# Altium schematic sheet bluenrg.SchDoc
size A3
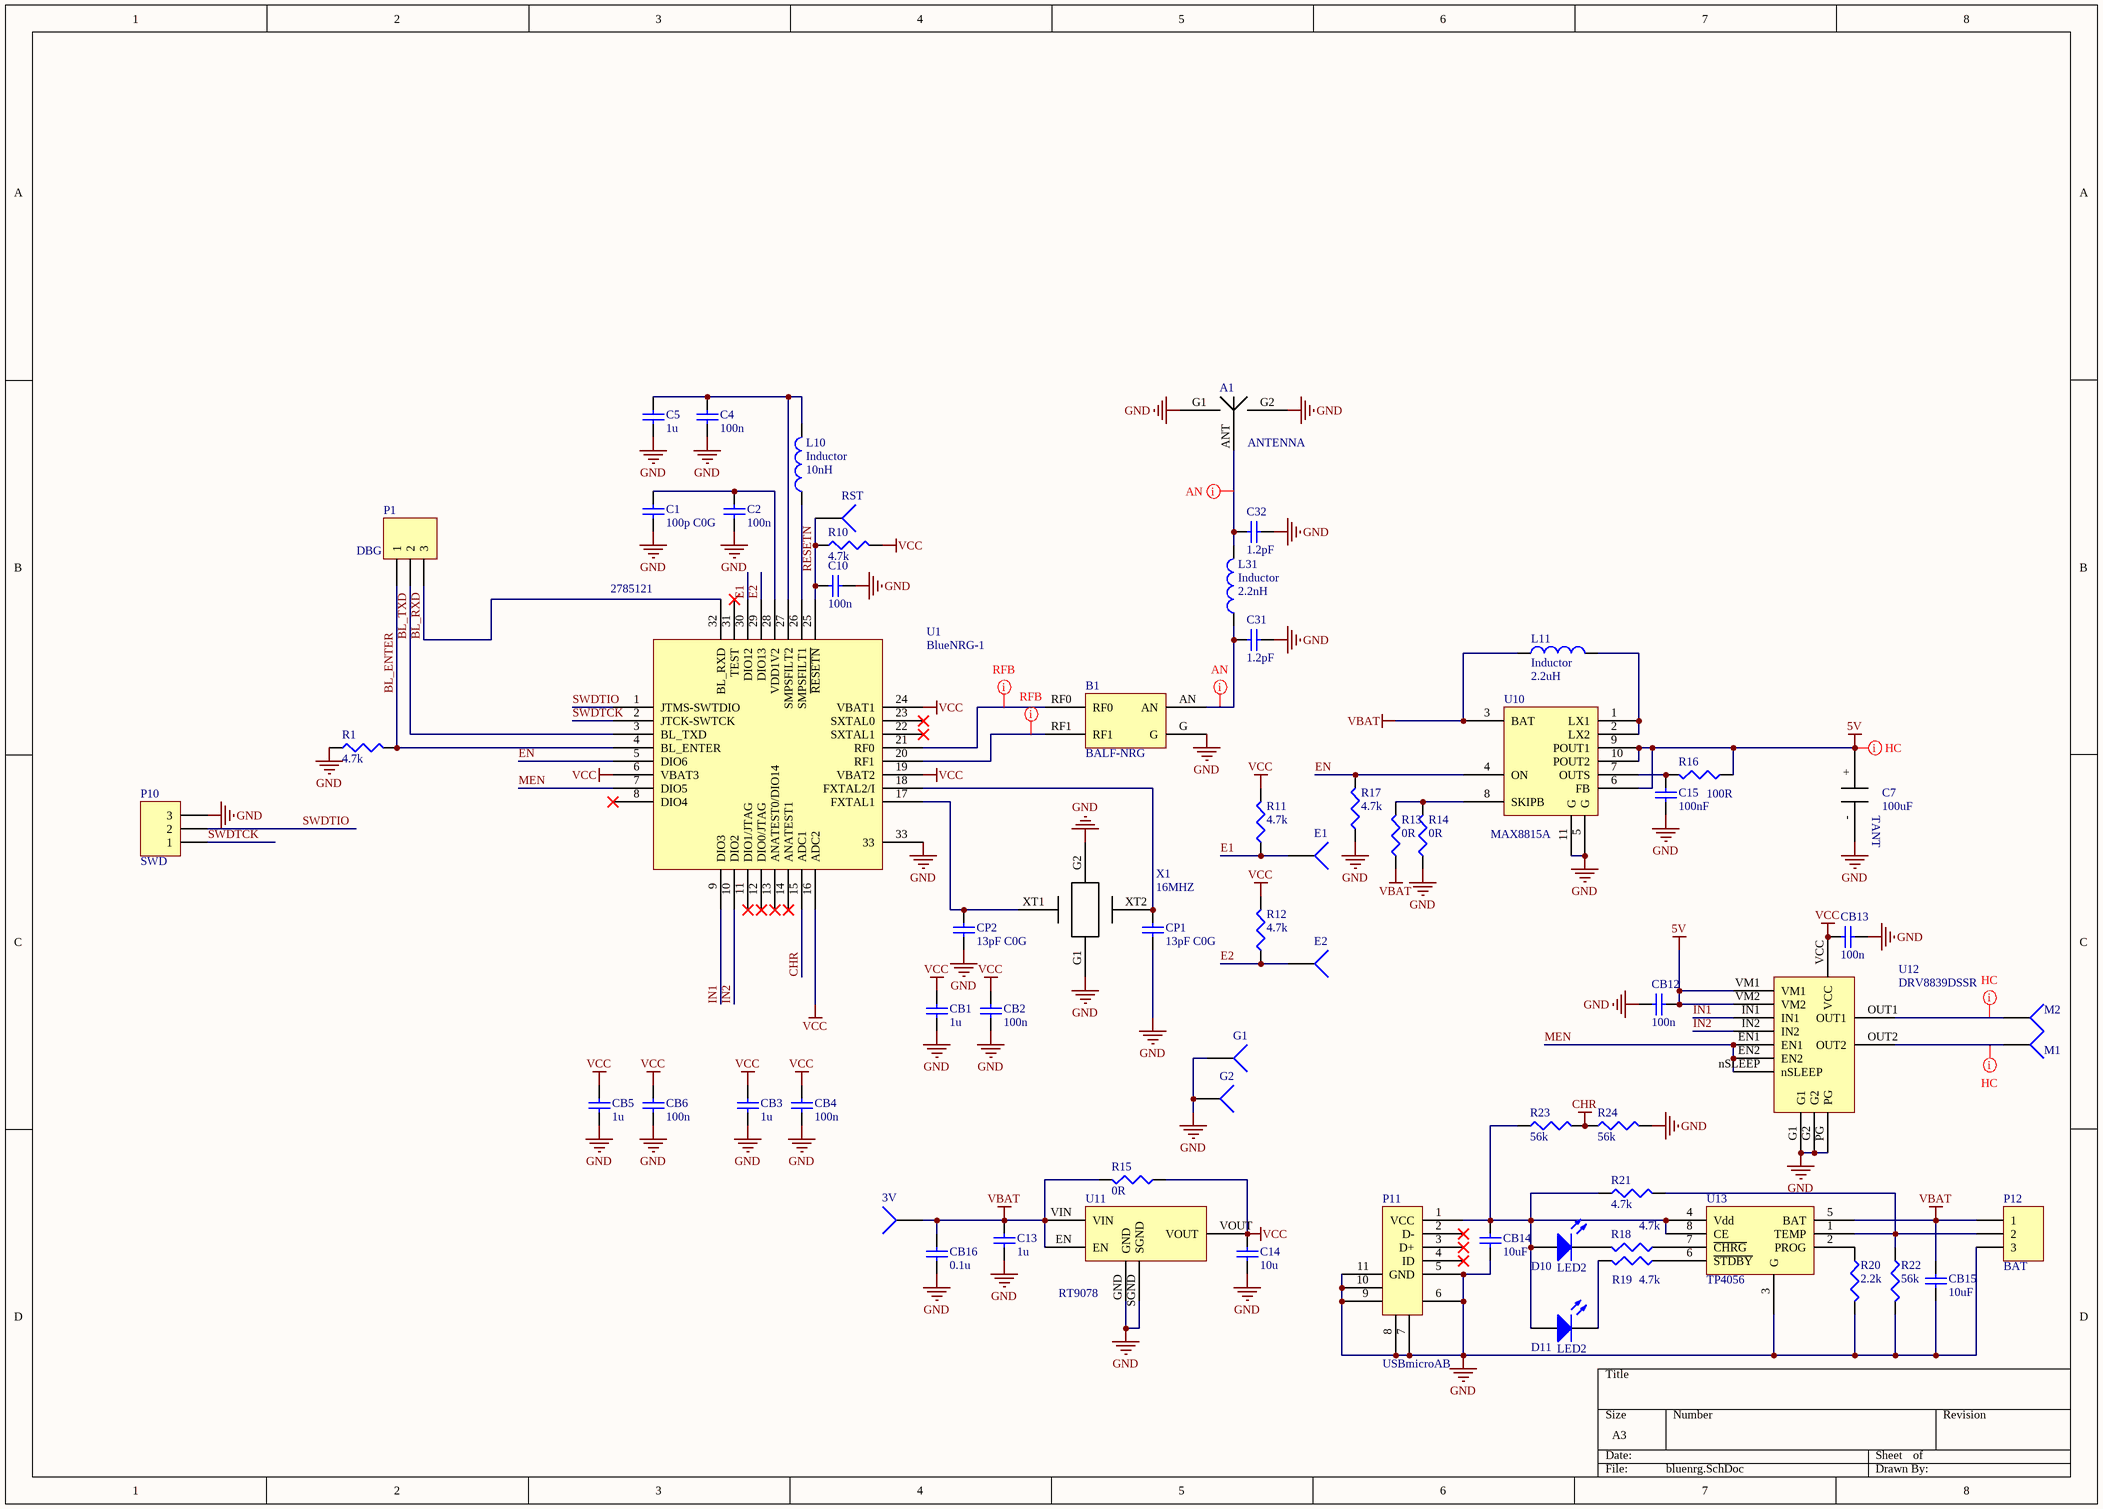
[diagram p0: bluenrg.SchDoc]

## Parts
3V  ENC  [MY_PAD]  (value not drawn)
A1  ANTENNA  [sma]
B1  BALF-NRG  [BALF-NRG]
C1  100p C0G  [0402]
C2  100n  [0402]
C4  100n  [0402]
C5  1u  [0402]
C7  100uF  [100uf_tant]
C10  100n  [0402]
C13  1u  [MY_0603]
C14  10u  [MY_0805]
C15  100nF  [MY_0603]
C31  1.2pF  [0402]
C32  1.2pF  [0402]
CB1  1u  [0402]
CB2  100n  [0402]
CB3  1u  [0402]
CB4  100n  [0402]
CB5  1u  [0402]
CB6  100n  [0402]
CB12  100n  [MY_0603]
CB13  100n  [MY_0603]
CB14  10uF  [MY_0805]
CB15  10uF  [MY_0805]
CB16  0.1u  [MY_0603]
CP1  13pF C0G  [MY_0402]
CP2  13pF C0G  [MY_0402]
D10  LED2  [MY_0603]
D11  LED2  [MY_0603]
E1  ENC  [MY_PAD]  (value not drawn)
E2  ENC  [MY_PAD]  (value not drawn)
G1  ENC  [MY_PAD]  (value not drawn)
G2  ENC  [MY_PAD]  (value not drawn)
L10  Inductor  value 10nH  [MY_0805]
L11  Inductor  value 2.2uH  [IND_4_4]
L31  Inductor  value 2.2nH  [MY_0402]
M1  M1  [MPAD]  (value not drawn)
M2  M2  [MPAD]  (value not drawn)
P1  DBG  [HDR1X3]
P10  SWD  [HDR1X3]
P11  USBmicroAB  [1981584]
P12  BAT  [HDR1X3]
R1  4.7k  [MY_0603]
R10  4.7k  [MY_0603]
R11  4.7k  [MY_0603]
R12  4.7k  [MY_0603]
R13  0R  [MY_0603]
R14  0R  [MY_0603]
R15  0R  [MY_0603]
R16  100R  [MY_0603]
R17  4.7k  [MY_0603]
R18  4.7k  [MY_0603]
R19  4.7k  [MY_0603]
R20  2.2k  [MY_0603]
R21  4.7k  [MY_0603]
R22  56k  [MY_0603]
R23  56k  [MY_0603]
R24  56k  [MY_0603]
RST  M1  [MY_PAD]  (value not drawn)
U1  BlueNRG-1  Supplier Part Number 1: 2785121  [BlueNRG-1]
U10  MAX8815A  [PDQN10]
U11  RT9078  [RT9078]
U12  DRV8839DSSR  [DRV8839]
U13  TP4056  [MY_SOIC8N]
X1  16MHZ  [16MHZ_25_20]

## Nets
5V: C7.+ CB12.2 R16.1 U10.6(FB) U10.9(POUT1) U10.10(POUT2) U12.VM1 U12.VM2
CHR: R23.2 R24.1 U1.15(ADC1)
GND: A1.G1 A1.G2 B1.G C1.1 C2.1 C4.1 C5.1 C7.- C10.1 C13.1 C14.1 C15.1 C31.2 C32.2 CB1.1 CB2.1 CB3.1 CB4.1 CB5.1 CB6.1 CB12.1 CB13.2 CB14.1 CB15.1 CB16.1 CP1.1 CP2.1 G1.1 G2.1 P10.3 P11.5(GND) P11.6 P11.7 P11.8 P11.9 P11.10 P11.11 P12.3 R1.1 R14.1 R17.1 R20.2 R22.2 R24.2 U1.33 U10.5(G) U10.11(G) U11.GND U11.SGND U12.G1 U12.G2 U12.PG U13.3(G) X1.G1 X1.G2
VBAT: 3V.1 C13.2 CB15.2 CB16.2 L11.1 P12.1 R13.1 R15.2 U10.3(BAT) U11.EN U11.VIN U13.5(BAT)
VCC: C14.2 CB1.2 CB2.2 CB3.2 CB4.2 CB5.2 CB6.2 CB13.1 R10.2 R11.2 R12.2 R15.1 U1.6(VBAT3) U1.16(ADC2) U1.19(VBAT2) U1.24(VBAT1) U11.VOUT U12.VCC
BL_ENTER: P1.1 R1.2 U1.4(BL_ENTER)
BL_RXD: P1.3 U1.32(BL_RXD)
BL_TXD: P1.2 U1.3(BL_TXD)
E1: E1.1 R11.1 U1.30(DIO12)
E2: E2.1 R12.1 U1.29(DIO13)
EN: R17.2 U1.5(DIO6) U10.4(ON)
IN1: U1.9(DIO3) U12.IN1
IN2: U1.10(DIO2) U12.IN2
MEN: U1.7(DIO5) U12.EN1 U12.EN2 U12.nSLEEP
RESETN: C10.2 R10.1 RST.1 U1.25(~{RESETN})
SWDTCK: P10.1 U1.2(JTCK-SWTCK)
SWDTIO: P10.2 U1.1(JTMS-SWTDIO)
NetA1_ANT: A1.ANT C32.1 L31.2
NetB1_AN: B1.AN C31.1 L31.1
NetB1_RF0: B1.RF0 U1.21(RF0)
NetB1_RF1: B1.RF1 U1.20(RF1)
NetC1_2: C1.2 C2.2 U1.28(VDD1V2)
NetC4_2: C4.2 C5.2 L10.2 U1.27(SMPSFILT2)
NetC15_2: C15.2 R16.2 U10.7(OUTS)
NetCB14_2: CB14.2 D10.1(A) D11.1(A) P11.1(VCC) R21.1 R23.1 U13.4(Vdd) U13.8(CE)
NetCP1_2: CP1.2 U1.18(FXTAL2/I) X1.XT2
NetCP2_2: CP2.2 U1.17(FXTAL1) X1.XT1
NetD10_2: D10.2(K) R18.2
NetD11_2: D11.2(K) R19.2
NetL10_1: L10.1 U1.26(SMPSFILT1)
NetL11_2: L11.2 U10.1(LX1) U10.2(LX2)
NetM1_1: M1.1 U12.OUT2
NetM2_1: M2.1 U12.OUT1
NetP12_2: P12.2 R21.2 R22.1 U13.1(TEMP)
NetR13_2: R13.2 R14.2 U10.8(SKIPB)
NetR18_1: R18.1 U13.7(~{CHRG})
NetR19_1: R19.1 U13.6(~{STDBY})
NetR20_1: R20.1 U13.2(PROG)

Not connected (* = marked no-connect by the designer): P11 2(D-)* 3(D+)* 4(ID)*; U1 8(DIO4)* 11(DIO1/JTAG)* 12(DIO0/JTAG)* 13(ANATEST0/DIO14)* 14(ANATEST1)* 22(SXTAL1)* 23(SXTAL0)* 31(TEST)*

## Layout directives
net class HC: 5V, NetM1_1, NetM2_1
net class RFB: NetB1_RF0, NetB1_RF1
net class AN: NetA1_ANT, NetB1_AN

## Notes on the sheet
- (in symbol C_TANT) TANT

## Library data of the parts
3V E1 E2 G1 G2 M1 M2 RST = Socket: LatestRevisionDate: 17-Jul-2002; LatestRevisionNote: Re-released for DXP Platform.; Publisher: Altium Limited
C1 C2 C4 C5 C10 C13-C15 C31 C32 CB1-CB6 CB12-CB16 CP1 CP2 = Cap Semi: Capacitor (Semiconductor SIM Model); Value: 100pF; Published: 8-Jun-2000; LatestRevisionDate: 29-May-2009; LatestRevisionNote: IPC-7351 Footprint Added.; PackageReference: C1206; Publisher: Altium Limited; PackageDescription: Chip Capacitor
C7 = C_TANT
D10 D11 = LED2: Typical RED, GREEN, YELLOW, AMBER GaAs LED; Published: 8-Jun-2000; LatestRevisionDate: 17-Jul-2002; LatestRevisionNote: Re-released for DXP Platform.; PackageVersion: Feb-2002; PackageReference: 3.2X1.6X1.1; Publisher: Altium Limited; PackageDescription: SM LED; 2 Flat Leads
L10 L11 L31 = Inductor: Code_IEC: 1005; Published: 8-Jun-2000; LatestRevisionDate: 29-May-2009; LatestRevisionNote: IPC-7351 Footprint Added.; PackageReference: 0402-A; Publisher: Altium Limited; PackageDescription: Chip Inductor; Code_JEITA: 0402
P1 P10 P12 = Header 3: Header, 3-Pin; LatestRevisionDate: 17-Jul-2002; LatestRevisionNote: Re-released for DXP Platform.; Publisher: Altium Limited
R1 R10-R12 R17-R19 R21 = Res3: Resistor; Published: 8-Jun-2000; LatestRevisionDate: 29-May-2009; LatestRevisionNote: IPC-7351 Footprint Added.; PackageReference: J1-0603; Publisher: Altium Limited; PackageDescription: Chip Resistor; Value: 4.7K
R13-R16 R20 R22-R24 = Res3: Resistor; Value: 4.7K; Published: 8-Jun-2000; LatestRevisionDate: 29-May-2009; LatestRevisionNote: IPC-7351 Footprint Added.; PackageReference: J1-0603; Publisher: Altium Limited; PackageDescription: Chip Resistor
X1 = XTAL_4PIN
U1 = BlueNRG-1: Supplier 1: Farnell